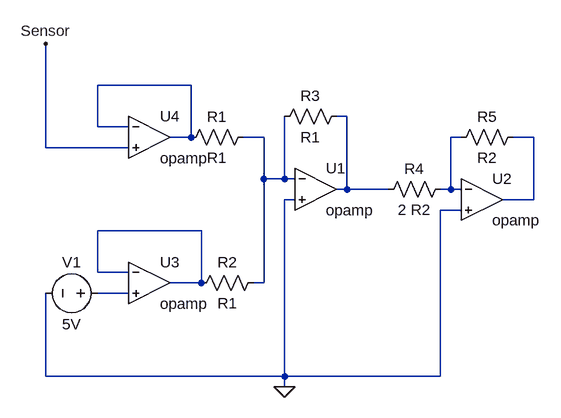
[diagram p0: schematic Ejercicio 2.asc]
Ejercicio 2.asc, the LTspice schematic file:
Version 4
SHEET 1 880 680
WIRE -112 32 -256 32
WIRE 128 80 112 80
WIRE -256 96 -256 32
WIRE -208 96 -256 96
WIRE -112 112 -112 32
WIRE -112 112 -144 112
WIRE 0 112 -32 112
WIRE 304 112 288 112
WIRE 416 112 384 112
WIRE -336 128 -336 -32
WIRE -208 128 -336 128
WIRE 0 176 0 112
WIRE 32 176 32 80
WIRE 32 176 0 176
WIRE 48 176 32 176
WIRE 128 192 128 80
WIRE 128 192 112 192
WIRE 192 192 128 192
WIRE 288 192 288 112
WIRE 288 192 272 192
WIRE 304 192 288 192
WIRE 48 208 32 208
WIRE 416 208 416 112
WIRE 416 208 368 208
WIRE 304 224 272 224
WIRE -96 256 -256 256
WIRE -256 320 -256 256
WIRE -208 320 -256 320
WIRE -96 336 -96 256
WIRE -96 336 -144 336
WIRE 0 336 0 176
WIRE 0 336 -16 336
WIRE -208 352 -256 352
WIRE -336 480 -336 352
WIRE 32 480 32 208
WIRE 32 480 -336 480
WIRE 272 480 272 224
WIRE 272 480 32 480
WIRE 32 496 32 480
FLAG -336 -32 Sensor
FLAG 32 496 0
SYMBOL OpAmps\\opamp 80 128 R0
SYMATTR InstName U1
SYMBOL OpAmps\\opamp 336 144 R0
SYMATTR InstName U2
SYMBOL OpAmps\\opamp -176 272 R0
SYMATTR InstName U3
SYMBOL OpAmps\\opamp -176 48 R0
SYMATTR InstName U4
SYMBOL voltage -240 352 R90
WINDOW 0 -32 56 VBottom 2
WINDOW 3 32 56 VTop 2
WINDOW 123 0 0 Left 0
WINDOW 39 0 0 Left 0
SYMATTR InstName V1
SYMATTR Value 5V
SYMBOL res -16 96 R90
WINDOW 0 0 56 VBottom 2
WINDOW 3 32 56 VTop 2
SYMATTR InstName R1
SYMATTR Value R1
SYMBOL res 0 320 R90
WINDOW 0 0 56 VBottom 2
WINDOW 3 32 56 VTop 2
SYMATTR InstName R2
SYMATTR Value R1
SYMBOL res 128 64 R90
WINDOW 0 0 56 VBottom 2
WINDOW 3 32 56 VTop 2
SYMATTR InstName R3
SYMATTR Value R1
SYMBOL res 288 176 R90
WINDOW 0 0 56 VBottom 2
WINDOW 3 32 56 VTop 2
SYMATTR InstName R4
SYMATTR Value 2 R2
SYMBOL res 400 96 R90
WINDOW 0 0 56 VBottom 2
WINDOW 3 32 56 VTop 2
SYMATTR InstName R5
SYMATTR Value R2

The netlist it stands for:
* Ejercicio 2.asc
XU1 N003 0 N002 opamp Aol=100K GBW=10Meg  ; pins invin noninvin out
XU2 N004 0 N005 opamp Aol=100K GBW=10Meg  ; pins invin noninvin out
XU3 N006 N007 N006 opamp Aol=100K GBW=10Meg  ; pins invin noninvin out
XU4 N001 Sensor N001 opamp Aol=100K GBW=10Meg  ; pins invin noninvin out
V1 N007 0 5V
R1 N003 N001 R1
R2 N003 N006 R1
R3 N002 N003 R1
R4 N004 N002 2 R2
R5 N005 N004 R2
.backanno
.end